# Altium schematic sheet 09_USB3_0_FIFO.SchDoc: USB3.0 device
size A3; Organization: Lime Microsystems; Address1: Surrey Tech Centre; Address2: Guildford GU2 7YG; Address3: Surray; Address4: United Kingdom; Revision: v2.2; SheetNumber: 9; SheetTotal: 10
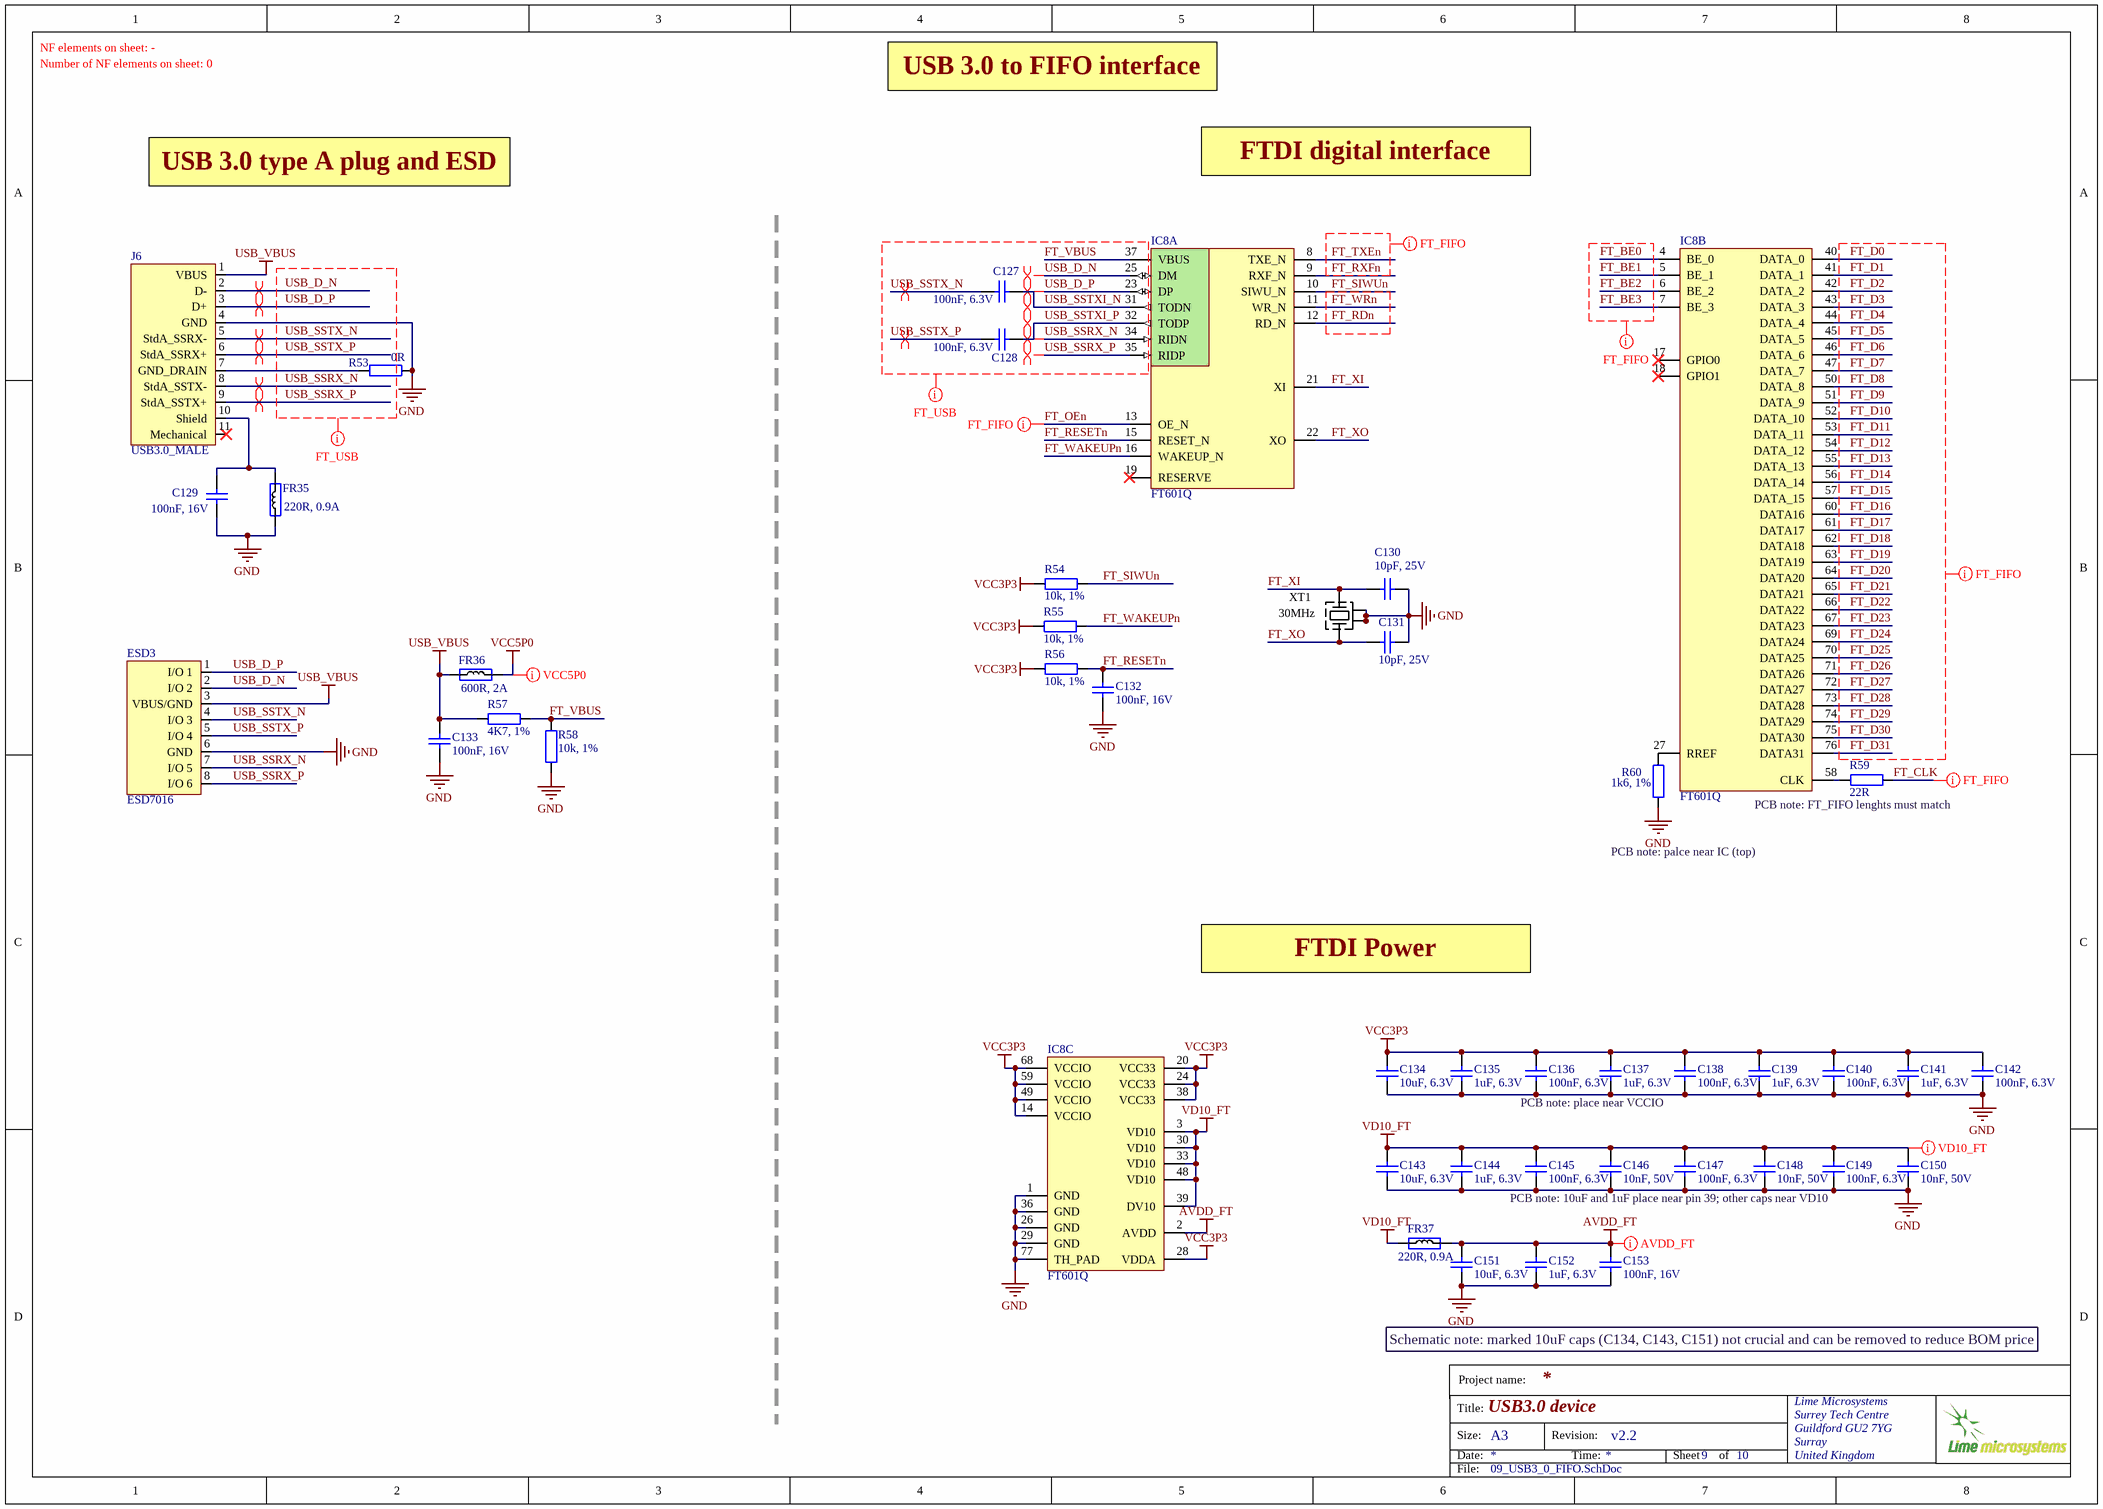
[diagram p0: 09_USB3_0_FIFO.SchDoc]

## Parts
C127  100nF, 6.3V  [CAP0201]
C128  100nF, 6.3V  [CAP0201]
C129  100nF, 16V  [CAP0402]
C130  10pF, 25V  [CAP0402]
C131  10pF, 25V  [CAP0402]
C132  100nF, 16V  [CAP0402]
C133  100nF, 16V  [CAP0402]
C134  10uF, 6.3V  [CAP0603]
C135  1uF, 6.3V  [CAP0201]
C136  100nF, 6.3V  [CAP0201]
C137  1uF, 6.3V  [CAP0201]
C138  100nF, 6.3V  [CAP0201]
C139  1uF, 6.3V  [CAP0201]
C140  100nF, 6.3V  [CAP0201]
C141  1uF, 6.3V  [CAP0201]
C142  100nF, 6.3V  [CAP0201]
C143  10uF, 6.3V  [CAP0603]
C144  1uF, 6.3V  [CAP0201]
C145  100nF, 6.3V  [CAP0201]
C146  10nF, 50V  [CAP0402]
C147  100nF, 6.3V  [CAP0201]
C148  10nF, 50V  [CAP0402]
C149  100nF, 6.3V  [CAP0201]
C150  10nF, 50V  [CAP0402]
C151  10uF, 6.3V  [CAP0603]
C152  1uF, 6.3V  [CAP0201]
C153  100nF, 16V  [CAP0402]
ESD3  ESD7016  [ESD7016]
FR35  220R, 0.9A  [RES0402]
FR36  600R, 2A  [RES0805]
FR37  220R, 0.9A  [RES0402]
IC8  FT601Q  [FT601Q]  (parts A,B,C of 3)
J6  USB3.0_MALE  [USB3A_SM]
R53  0R  [RES0402]
R54  10k, 1%  [RES0402]
R55  10k, 1%  [RES0402]
R56  10k, 1%  [RES0402]
R57  4K7, 1%  [RES0402]
R58  10k, 1%  [RES0402]
R59  22R  [RES0402]
R60  1k6, 1%  [RES0402]
XT1  30MHz  [CRYSTAL_4-LCC]

## Nets
AVDD_FT: C151.2 C152.2 C153.1 FR37.2 IC8.2(AVDD)
GND: C129.2 C130.2 C131.2 C132.2 C133.2 C134.1 C135.1 C136.2 C137.1 C138.2 C139.1 C140.2 C141.1 C142.2 C143.1 C144.1 C145.2 C146.2 C147.2 C148.2 C149.2 C150.2 C151.1 C152.1 C153.2 ESD3.6(GND) FR35.1 IC8.1(GND) IC8.26(GND) IC8.29(GND) IC8.36(GND) IC8.77(TH_PAD) J6.4(GND) R53.1 R58.1 R60.1 XT1.2(GND) XT1.4(GND)
USB_VBUS: C133.1 ESD3.3(VBUS/GND) FR36.1 J6.1(VBUS) R57.2
VCC3P3: C134.2 C135.2 C136.1 C137.2 C138.1 C139.2 C140.1 C141.2 C142.1 IC8.14(VCCIO) IC8.20(VCC33) IC8.24(VCC33) IC8.28(VDDA) IC8.38(VCC33) IC8.49(VCCIO) IC8.59(VCCIO) IC8.68(VCCIO) R54.2 R55.2 R56.2
VCC5P0: FR36.2
VD10_FT: C143.2 C144.2 C145.1 C146.1 C147.1 C148.1 C149.1 C150.1 FR37.1 IC8.3(VD10) IC8.30(VD10) IC8.33(VD10) IC8.39(DV10) IC8.48(VD10)
FT_BE0: IC8.4(BE_0)
FT_BE1: IC8.5(BE_1)
FT_BE2: IC8.6(BE_2)
FT_BE3: IC8.7(BE_3)
FT_CLK: R59.1
FT_D0: IC8.40(DATA_0)
FT_D1: IC8.41(DATA_1)
FT_D2: IC8.42(DATA_2)
FT_D3: IC8.43(DATA_3)
FT_D4: IC8.44(DATA_4)
FT_D5: IC8.45(DATA_5)
FT_D6: IC8.46(DATA_6)
FT_D7: IC8.47(DATA_7)
FT_D8: IC8.50(DATA_8)
FT_D9: IC8.51(DATA_9)
FT_D10: IC8.52(DATA_10)
FT_D11: IC8.53(DATA_11)
FT_D12: IC8.54(DATA_12)
FT_D13: IC8.55(DATA_13)
FT_D14: IC8.56(DATA_14)
FT_D15: IC8.57(DATA_15)
FT_D16: IC8.60(DATA16)
FT_D17: IC8.61(DATA17)
FT_D18: IC8.62(DATA18)
FT_D19: IC8.63(DATA19)
FT_D20: IC8.64(DATA20)
FT_D21: IC8.65(DATA21)
FT_D22: IC8.66(DATA22)
FT_D23: IC8.67(DATA23)
FT_D24: IC8.69(DATA24)
FT_D25: IC8.70(DATA25)
FT_D26: IC8.71(DATA26)
FT_D27: IC8.72(DATA27)
FT_D28: IC8.73(DATA28)
FT_D29: IC8.74(DATA29)
FT_D30: IC8.75(DATA30)
FT_D31: IC8.76(DATA31)
FT_OEn: IC8.13(OE_N)
FT_RDn: IC8.12(RD_N)
FT_RESETn: C132.1 IC8.15(RESET_N) R56.1
FT_RXFn: IC8.9(RXF_N)
FT_SIWUn: IC8.10(SIWU_N) R54.1
FT_TXEn: IC8.8(TXE_N)
FT_VBUS: IC8.37(VBUS) R57.1 R58.2
FT_WAKEUPn: IC8.16(WAKEUP_N) R55.1
FT_WRn: IC8.11(WR_N)
FT_XI: C130.1 IC8.21(XI) XT1.3(X)
FT_XO: C131.1 IC8.22(XO) XT1.1(X)
USB_D_N: ESD3.2(I/O_2) IC8.25(DM) J6.2(D-)
USB_D_P: ESD3.1(I/O_1) IC8.23(DP) J6.3(D+)
USB_SSRX_N: ESD3.7(I/O_5) IC8.34(RIDN) J6.8(StdA_SSTX-)
USB_SSRX_P: ESD3.8(I/O_6) IC8.35(RIDP) J6.9(StdA_SSTX+)
USB_SSTX_N: C127.1 ESD3.4(I/O_3) J6.5(StdA_SSRX-)
USB_SSTX_P: C128.1 ESD3.5(I/O_4) J6.6(StdA_SSRX+)
USB_SSTXI_N: C127.2 IC8.31(TODN)
USB_SSTXI_P: C128.2 IC8.32(TODP)
NetC129_1: C129.1 FR35.2 J6.10(Shield)
NetIC8_27: IC8.27(RREF) R60.2
NetIC8_58: IC8.58(CLK) R59.2
NetJ6_7: J6.7(GND_DRAIN) R53.2

Not connected (* = marked no-connect by the designer): IC8 17(GPIO0)* 18(GPIO1)* 19(RESERVE)*; J6 11(Mechanical)*

## Layout directives
net class FT_FIFO: FT_BE0, FT_BE1, FT_BE2, FT_BE3, FT_CLK, FT_D0, FT_D1, FT_D2, FT_D3, FT_D4, FT_D5, FT_D6, FT_D7, FT_D8, FT_D9, FT_D10, FT_D11, FT_D12, FT_D13, FT_D14, FT_D15, FT_D16, FT_D17, FT_D18, FT_D19, FT_D20, FT_D21, FT_D22, FT_D23, FT_D24, FT_D25, FT_D26, FT_D27, FT_D28, FT_D29, FT_D30, FT_D31, FT_OEn, FT_RXFn, FT_TXEn
net class VCC5P0: VCC5P0
differential pair: USB_D_N, USB_D_P, USB_SSRX_N, USB_SSRX_P, USB_SSTX_N, USB_SSTX_P, USB_SSTXI_N, USB_SSTXI_P
net class FT_USB: FT_VBUS, USB_D_N, USB_D_P, USB_SSRX_N, USB_SSRX_P, USB_SSTX_N, USB_SSTX_P, USB_SSTXI_N, USB_SSTXI_P
net class VD10_FT: VD10_FT
net class AVDD_FT: AVDD_FT

## Notes on the sheet
- NF elements on sheet: -
- Number of NF elements on sheet: 0
- USB 3.0 to FIFO interface
- USB 3.0 type A plug and ESD
- FTDI digital interface
- PCB note: palce near IC (top)
- PCB note: FT_FIFO lenghts must match
- FTDI Power
- PCB note: place near VCCIO
- PCB note: 10uF and 1uF place near pin 39; other caps near VD10
- Schematic note: marked 10uF caps (C134, C143, C151) not crucial and can be removed to reduce BOM price
- Project name:
- Title:
- Size:
- Date:
- A3
- Revision:
- Time:
- Sheet
- of
- File:

## Library data of the parts
C127 C128 C136 C138 C140 C142 C145 C147 C149 = Cap_0402: Manufacturer: Murata; Manufacturer Part Number 1: GRT033C81A104KE01D; Part Description: 0.10µF ±10% 6.3V X6S Ceramic Capacitor -55°C ~ 105°C Surface Mount, MLCC 0201 (0603 Metric) 0.024" L x 0.012" W (0.60mm x 0.30mm); Capacitance: 0.1 uF; Dielectric: X6S; Brand: Murata Electronics; Type: Voltage and Temperature Derating Recommended Product; Voltage Rating DC: 6.3 VDC; Product Status: New Product; Tolerance: 10 %; Value: 100nF, 6.3V; Package / Case: 0201 (0603 metric); Width: 0.3 mm; Minimum Order Quantity: 1; Category: Multilayer Ceramic Capacitors MLCC - SMD/SMT; Termination Style: SMD/SMT; Case Code - mm: 0603; Maximum Operating Temperature: + 125 C; Length: 0.6 mm; Product: General Type MLCCs; Case Code - in: 0201; RoHS: RoHS Compliant; Minimum Operating Temperature: - 55 C; RoHS - Mouser: Y; Height: 0.3 mm; Packaging: Reel; Series: GRM; Reeling: True; Supplier 1: Digi-Key; Supplier Part Number 1: 490-12232-1-ND
C129 C132 C133 = Cap_0603: Manufacturer Part Number 1: GRM155R71C104KA88D; Part Description: 0.10µF ±10% 16V X7R Ceramic Capacitor -55°C ~ 125°C Surface Mount, MLCC 0402 (1005 Metric) 0.039" L x 0.020" W (1.00mm x 0.50mm); Brand: Murata Electronics; Tolerance: 10 %; Type: General Purpose MLCC; Capacitance: 0.1 uF; Temperature Coefficient / Code: +/- 15 %; Case Height: 0.5 mm; Case Length: 1 mm; Dielectric: X7R; Supplier 1: Mouser; Supplier Part Number 1: 81-GRM155R71C104KA88; Case Code - in: 0402; Manufacturer: Murata Electronics; Category: Multilayer Ceramic Capacitors MLCC - SMD/SMT; Voltage Rating DC: 16 V; Value: 100nF, 16V; Manufacturer Part Number: GRM155R71C104KA88D; Case Code - mm: 1005; Case Width: 0.5 mm; Maximum Operating Temperature: + 125 C; Minimum Operating Temperature: - 55 C; Minimum Order Quantity: 1; Operating Temperature Range: - 55 C to + 125 C; Package / Case: 0402 (1005 metric); Packaging: Reel; Product: General Type MLCCs; Product Category: Low & Medium Capacitance SMD Ceramic Chip Capacitors; Reeling: True; RoHS - Mouser: Y; RoHS: RoHS Compliant; Series: GRM; Standard Pack Qty: 10000; Termination Style: SMD/SMT
C130 C131 = Cap_0402: Manufacturer: AVX; Manufacturer Part Number 1: 04023A100JAT2A; Part Description: 10pF ±5% 25V C0G, NP0 Ceramic Capacitor -55°C ~ 125°C Surface Mount, MLCC 0402 (1005 Metric) 0.039" L x 0.020" W (1.00mm x 0.50mm); Capacitance: 10; Ceramic Capacitor Case: 0402 [1005 Metric]; Capacitance Tolerance: ± 5%; Capacitor Case Style: 0402 [1005 Metric]<!--FANDB--><div class="features-and-benefits-container"></div>; Voltage Rating: 25; Supplier 1: Farnell; Supplier Part Number 1: 2332478RL; value: 10pF, 25V; Capacitance Tolerance ±: ± 5%; MSL: MSL 1 - Unlimited; Operating Temperature Max: 125; Operating Temperature Min: -55; Packaging: Cut Tape
C134 C143 C151 = Cap_0603: Manufacturer Part Number 1: CC0603MRX5R5BB106; Manufacturer: Yageo; Part Description: 10µF ±20% 6.3V X5R Ceramic Capacitor -55°C ~ 85°C Surface Mount, MLCC 0603 (1608 Metric) 0.063" L x 0.031" W (1.60mm x 0.80mm); Capacitance: 10µF; Tolerance: ±20%; Supplier 1: Digi-Key; Supplier Part Number 1: 311-1448-2-ND; Package / Case: 0603 (1608 Metric); Category: Capacitors; Voltage - Rated: 6.3V; Value: 10uF, 6.3V
C135 C137 C139 C141 C144 C152 = Cap_0402: Manufacturer: TDK Corporation; Manufacturer Part Number 1: JMK063ABJ105MP-F; Part Description: 1µF ±20% 6.3V X5R Ceramic Capacitor -55°C ~ 85°C Surface Mount, MLCC 0201 (0603 Metric) 0.024" L x 0.012" W (0.60mm x 0.30mm); Tolerance: ±20%; Capacitance: 1.0µF; Temperature Coefficient: X5R; Value: 1uF, 6.3V; Supplier 1: Digi-Key; Supplier Part Number 1: 587-5864-2-ND; Applications: General Purpose; Features: -; Lead Style: -; Ratings: -; Thickness (Max): -; Lead Spacing: -; Height - Seated (Max): -; Size / Dimension: 0.024" L x 0.012" W (0.60mm x 0.30mm); Mounting Type: Surface Mount, MLCC; Operating Temperature: -55°C ~ 85°C; Package / Case: 0201 (0603 Metric); Packaging: Cut Tape (CT); Voltage - Rated: 6.3V; Category: Capacitors; RoHS: RoHS Compliant
C146 C148 C150 = Cap_0402: Part Description: 10000pF ±10% 50V Ceramic Capacitor X7R 0402 (1005 Metric); Manufacturer: Murata; Manufacturer Part Number 1: GRM155R71H103KA88D; Tolerance: 10%; Dielectric: X7R; Material: Ceramic; Voltage: 25V; Value: 10nF, 50V; Supplier 1: Digi-Key; Supplier Part Number 1: 490-4516-1-ND; RoHS: Yes; Stock 1: 8941817; Pricing 1: 1=0,10000, 10=0,03800, 100=0,01690, 500=0,01208, 1000=0,00949, 2500=0,00862, 5000=0,00794 (USD); Packaging: Tape and Reel; Capacitance: 10nF; Case/Package: 0402; Case Code (Imperial): 0402; Case Code (Metric): 1005; Depth: 0.5mm; Height: 0.5mm; Lead Free: Lead Free; Length: 1mm; Max Operating Temperature: 125°C; Min Operating Temperature: -55°C; Mount: Surface Mount; Number of Pins: 2; Package Quantity: 1; Radiation Hardening: No; REACH SVHC: No SVHC; Termination: SMD/SMT; Thickness: 0.022inch; Voltage Rating (DC): 50V; Voltage Rating: 50V; Width: 0.02inch
C153 = Cap_0402: Manufacturer: Murata Electronics; Manufacturer Part Number: GRM155R71C104KA88D; Part Description: 0.10µF ±10% 16V X7R Ceramic Capacitor -55°C ~ 125°C Surface Mount, MLCC 0402 (1005 Metric) 0.039" L x 0.020" W (1.00mm x 0.50mm); Tolerance: 10 %; Type: General Purpose MLCC; Capacitance: 0.1 uF; Case Length: 1 mm; Dielectric: X7R; Case Height: 0.5 mm; Temperature Coefficient / Code: +/- 15 %; Value: 100nF, 16V; Supplier 1: Mouser; Supplier Part Number 1: 81-GRM155R71C104KA88; Case Code - in: 0402; RoHS: RoHS Compliant; Operating Temperature Range: - 55 C to + 125 C; Series: GRM; Termination Style: SMD/SMT; Package / Case: 0402 (1005 metric); Voltage Rating DC: 16 V; Maximum Operating Temperature: + 125 C; Case Code - mm: 1005; Minimum Operating Temperature: - 55 C; Product Category: Low & Medium Capacitance SMD Ceramic Chip Capacitors; Packaging: Reel; Product: General Type MLCCs; Category: Multilayer Ceramic Capacitors MLCC - SMD/SMT; Brand: Murata Electronics; Case Width: 0.5 mm; RoHS - Mouser: Y; Standard Pack Qty: 10000; Minimum Order Quantity: 1; Reeling: True; Manufacturer Part Number 1: GRM155R71C104KA88D
ESD3 = ESD7016: Manufacturer Part Number 1: ESD7016MUTAG; Manufacturer: ON Semiconductor; Part Description: TVS DIODE 5VWM 10VC 8UDFN; Unidirectional Channels: 8; Capacitance @ Frequency: 0.15pF @ 1MHz; Power Line Protection: No; Voltage - Reverse Standoff (Typ): 5V (Max); Voltage - Breakdown (Min): 5.5V; Current - Peak Pulse (10/1000µs): 1A (8/20µs); Voltage - Clamping (Max) @ Ipp: 10V; Supplier 1: Digi-Key; Category: Circuit Protection; RoHS: RoHS Compliant; Bidirectional Channels: -; Packaging: Digi-Reel®; Type: Zener; Operating Temperature: -55°C ~ 125°C (TJ); Mounting Type: Surface Mount; Power - Peak Pulse: -; Package / Case: 8-UFSFN; Supplier Device Package: 8-UDFN (3.3x1.0); Applications: General Purpose; Supplier Part Number 1: ESD7016MUTAGOSDKR-ND
FR35 FR37 = Ferrite: Manufacturer: TDK Corporation; Manufacturer Part Number 1: MPZ1005S221ET000; Part Description: FERRITE BEAD 220 OHM 0402 1LN; Impedance @ Frequency: 220 Ohm @ 100MHz; Current Rating: 900mA; DC Resistance (DCR): 220 mOhm Max; Supplier 1: Digi-Key; Package / Case: 0402 (1005 Metric); Category: Filters; Supplier Part Number 1: 445-9329-2-ND; Value: 220R, 0.9A
FR36 = Ferrite: Manufacturer Part Number 1: MPZ2012S601AT000; Manufacturer: TDK Corporation; Part Description: FERRITE BEAD 600 OHM 0805 1LN; Filter Type: Differential Mode - Single; Impedance @ Frequency: 600 Ohm @ 100MHz; DC Resistance (DCR): 100 mOhm Max; Supplier 1: Digi-Key; Supplier Part Number 1: 445-2206-2-ND; Mounting Type: Surface Mount; RoHS: RoHS Compliant; Height (Max): 0.041" (1.05mm); Packaging: Tape & Reel (TR); Category: Filters; Current Rating: 2A; Package / Case: 0805 (2012 Metric); Size / Dimension: 0.079" L x 0.049" W (2.00mm x 1.25mm)
IC8 = FT601Q: Manufacturer: FTDI, Future Technology Devices International Ltd; Manufacturer Part Number 1: FT601Q-B-T; Part Description: IC USB3-32BIT SYNC FIFO 76QFN; Function: Bridge, USB to FIFO; Standards: USB 3.0; Voltage - Supply: 1.65 V ~ 3.6 V; Protocol: USB; Interface: FIFO; Supplier 1: Digi-Key; Operating Temperature: -40°C ~ 85°C; Packaging: Tray; Category: Integrated Circuits (ICs); Package / Case: 76-VFQFN Exposed Pad; Supplier Device Package: 76-QFN (9x9); Current - Supply: -; RoHS: RoHS Compliant; Supplier Part Number 1: 768-1311-ND
J6 = USB3.0_MALE: Manufacturer: Wurth Electronics Inc.; Manufacturer Part Number 1: 692112030100; Part Description: USB - A USB 3.0 (USB 3.1 Gen 1, Superspeed) Plug Connector 9 Position Surface Mount, Right Angle; Connector Type: USB - A; Number of Contacts: 9; Gender: Plug; Specifications: USB 3.0 (USB 3.1 Gen 1, Superspeed); Number of Ports: 1; Current Rating: 0.25A, 1.8A; Voltage - Rated: 30VAC; Mating Cycles: 5000; Shielding: Shielded; Material Flammability Rating: UL94 V-0; Supplier 1: Digi-Key; Supplier Part Number 1: 732-3157-ND; RoHS: RoHS Compliant; Category: Connectors, Interconnects; Stock 1: 2119; Pricing 1: 1=3, 10=2.65, 50=2.497, 100=2.242, 500=2.03802 (USD); Packaging: Tray; Part Status: Active; Mounting Type: Surface Mount, Right Angle; Mounting Feature: Horizontal; Termination: Solder; Features: Board Guide, Board Lock; Ingress Protection: -; Operating Temperature: -20°C ~ 85°C; Contact Finish: Gold; Shell/Shielding Material: Steel; Insulation Color: Blue; ComponentLink1URL: http://katalog.we-online.de/em/datasheet/692112030100.pdf; ComponentLink1Description: http://katalog.we-online.de/em/datasheet/692112030100.pdf
R53 = Res_0402: Manufacturer Part Number 1: RC0402JR-070RL; Manufacturer: Yageo; Part Description: RES SMD 0.0OHM JUMPER 1/16W 0402; Resistance (Ohms): 0.0; Tolerance: Jumper; Power (Watts): 0.063W, 1/16W; Value: 0R; Supplier 1: Digi-Key; Supplier Part Number 1: 311-0.0JRTR-ND; Category: Resistors; Temperature Coefficient: -; Features: Moisture Resistant; Supplier Device Package: 0402; Height: 0.016" (0.40mm); Package / Case: 0402 (1005 Metric); Operating Temperature: -55°C ~ 155°C; Size / Dimension: 0.039" L x 0.020" W (1.00mm x 0.50mm); Composition: Thick Film; Packaging: Tape & Reel (TR); Number of Terminations: 2; RoHS: RoHS Compliant
R54-R56 R58 = Res_0402: Manufacturer: Yageo; Manufacturer Part Number 1: RC0402FR-0710KL; Part Description: RES SMD 10K OHM 1% 1/16W 0402; Temperature Coefficient: ±100ppm/°C; Power (Watts): 0.063W, 1/16W; Value: 10k, 1%; Supplier 1: Digi-Key; Supplier Part Number 1: 311-10.0KLRTR-ND; Resistance (Ohms): 10k; Packaging: Tape & Reel (TR); RoHS: RoHS Compliant; Package / Case: 0402 (1005 Metric); Tolerance: ±1%; Operating Temperature: -55°C ~ 155°C; Size / Dimension: 0.039" L x 0.020" W (1.00mm x 0.50mm); Number of Terminations: 2; Category: Resistors; Height: 0.016" (0.40mm); Supplier Device Package: 0402; Features: Moisture Resistant; Composition: Thick Film
R57 = Res_0402: Manufacturer: Yageo; Manufacturer Part Number 1: RC0402FR-074K7L; Part Description: ±1% 0.063W, 1/16W Chip Resistor 0402 (1005 Metric) Moisture Resistant Thick Film; Power (Watts): 0.063W, 1/16W; Temperature Coefficient: ±100ppm/°C; Supplier 1: Digi-Key; Supplier Part Number 1: 311-4.7KLRCT-ND; RoHS: RoHS Compliant; Category: Resistors; Stock 1: 4788231; Pricing 1: 1=0.1, 10=0.014, 100=0.0056, 1000=0.00253, 2500=0.0022, 5000=0.00181 (USD); Packaging: Cut Tape (CT); Part Status: Active; Tolerance: ±1%; Composition: Thick Film; Features: Moisture Resistant; Operating Temperature: -55°C ~ 155°C; Package / Case: 0402 (1005 Metric); Supplier Device Package: 0402; Size / Dimension: 0.039" L x 0.020" W (1.00mm x 0.50mm); Height - Seated (Max): 0.016" (0.40mm); Failure Rate: -; ComponentLink1URL: http://www.yageo.com/documents/recent/PYu-RC_Group_51_RoHS_L_7.pdf; ComponentLink1Description: http://www.yageo.com/documents/recent/PYu-RC_Group_51_RoHS_L_7.pdf; Value: 4K7, 1%
R59 = Res_0402: Part Description: RES SMD 22 OHM 1% 1/16W 0402; Manufacturer Part Number 1: RC0402FR-0722RL; Manufacturer: Yageo; Tolerance: ±1%; Temperature Coefficient: ±100ppm/°C; Resistance (Ohms): 22; Supplier 1: Digi-Key; Supplier Part Number 1: 311-22.0LRTR-ND; Supplier Device Package: 0402; Composition: Thick Film; Category: Resistors; Value: 22R
R60 = Res_0402: Manufacturer Part Number 1: RC0402FR-071K6L; Manufacturer: Yageo; Part Description: RES SMD 1.6K OHM 1% 1/16W 0402; Resistance (Ohms): 1.6k; Temperature Coefficient: ±100ppm/°C; Power (Watts): 0.063W, 1/16W; Value: 1k6, 1%; Number of Terminations: 2; Height: 0.016" (0.40mm); Supplier Device Package: 0402; Size / Dimension: 0.039" L x 0.020" W (1.00mm x 0.50mm); Supplier Part Number 1: YAG3045CT-ND; Features: Moisture Resistant; Operating Temperature: -55°C ~ 155°C; Supplier 1: Digi-Key; Category: Resistors; RoHS: RoHS Compliant; Packaging: Cut Tape (CT); Composition: Thick Film; Tolerance: ±1%; Package / Case: 0402 (1005 Metric)
XT1 = CRYSTAL_19M2: Oscillator Crystal 25 MHz; Manufacturer: AVX Corp/Kyocera Corp; Manufacturer Part Number 1: CX3225SB30000D0FPLCC; Part Description: 30MHz ±10ppm Crystal 8pF 50 Ohm -40°C ~ 85°C Surface Mount 4-SMD, No Lead (DFN, LCC); Operating Mode: Fundamental; Frequency Tolerance: ±10ppm; Frequency Stability: ±20ppm; Load Capacitance: 8pF; ESR (Equivalent Series Resistance): 50 Ohm; Height: 0.024" (0.60mm); Size / Dimension: 0.126" L x 0.098" W (3.20mm x 2.50mm); Mounting Type: Surface Mount; Package / Case: 4-SMD, No Lead (DFN, LCC); Category: Crystals and Oscillators; Ratings: -; Supplier 1: Digi-Key; Operating Temperature: -40°C ~ 85°C; Packaging: Cut Tape (CT); RoHS: RoHS Compliant; Type: MHz Crystal; Supplier Part Number 1: 1253-1368-1-ND; Frequency: 30MHz; Value: 30MHz